# EAGLE design MM-Schematic (EAGLE 8.2.2)
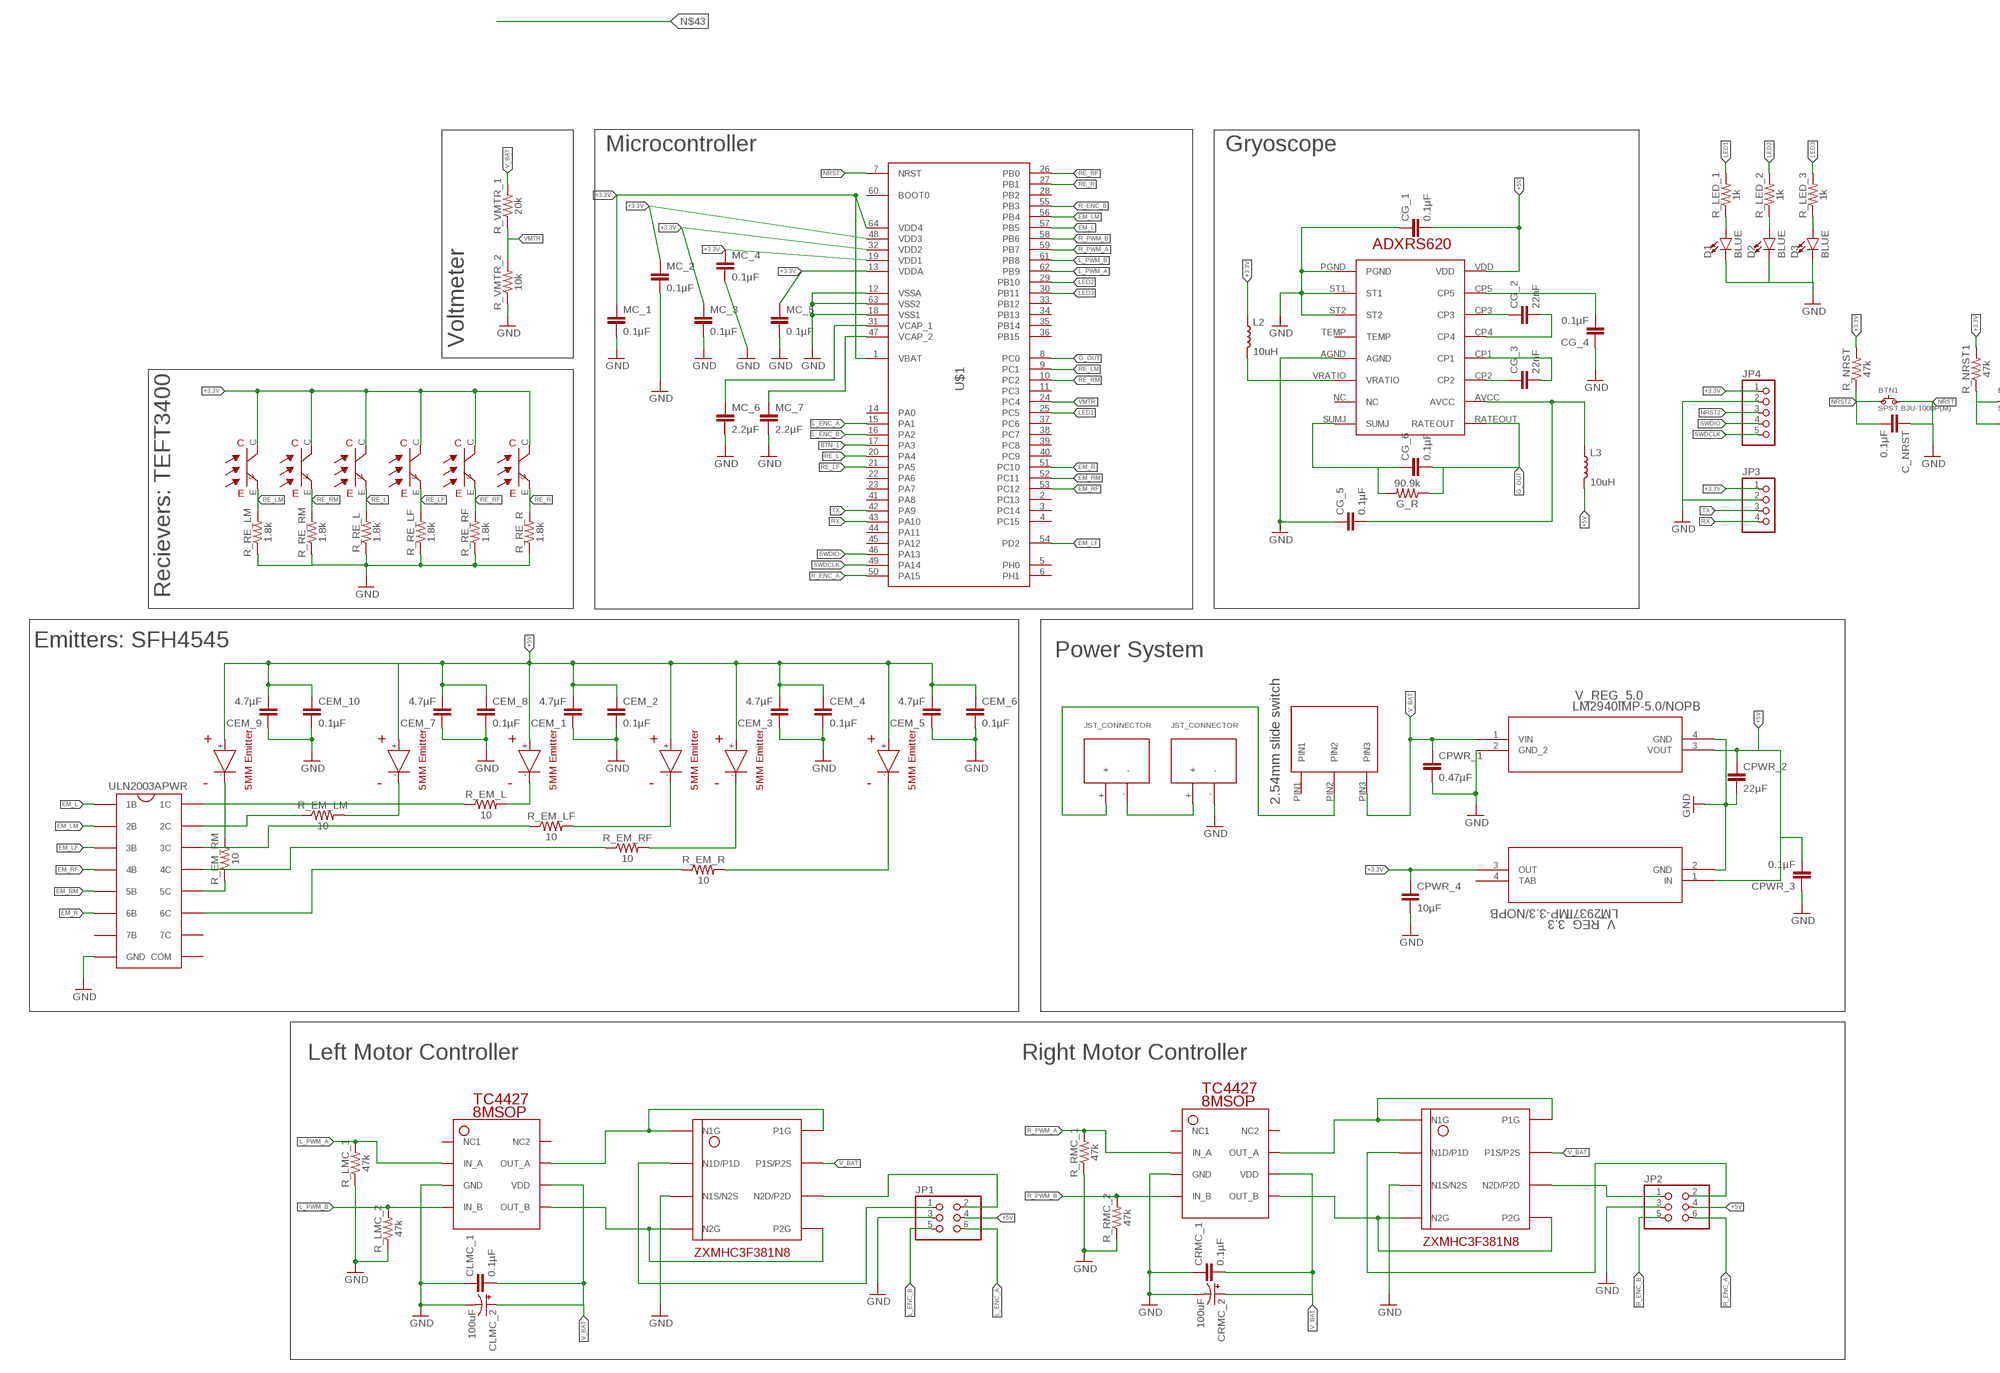
[diagram p0: schematic, sheet 1, part 1 of 2]
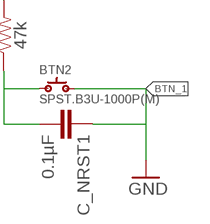
[diagram p1: schematic, sheet 1, part 2 of 2]

## Parts
BTN1  SPST.B3U-1000P(M)  [B3U-1000P(M)]
BTN2  SPST.B3U-1000P(M)  [B3U-1000P(M)]
C_NRST  0.1µF  0.33UF/330NF-0805-50V-10%  [0805]
C_NRST1  0.1µF  0.33UF/330NF-0805-50V-10%  [0805]
CEM_1  4.7µF  0.33UF/330NF-0805-50V-10%  [0805]
CEM_2  0.1µF  0.33UF/330NF-0805-50V-10%  [0805]
CEM_3  4.7µF  0.33UF/330NF-0805-50V-10%  [0805]
CEM_4  0.1µF  0.33UF/330NF-0805-50V-10%  [0805]
CEM_5  4.7µF  0.33UF/330NF-0805-50V-10%  [0805]
CEM_6  0.1µF  0.33UF/330NF-0805-50V-10%  [0805]
CEM_7  4.7µF  0.33UF/330NF-0805-50V-10%  [0805]
CEM_8  0.1µF  0.33UF/330NF-0805-50V-10%  [0805]
CEM_9  4.7µF  0.33UF/330NF-0805-50V-10%  [0805]
CEM_10  0.1µF  0.33UF/330NF-0805-50V-10%  [0805]
CG_1  0.1µF  0.33UF/330NF-0805-50V-10%  [0805]
CG_2  22nF  0.33UF/330NF-0805-50V-10%  [0805]
CG_3  22nF  0.33UF/330NF-0805-50V-10%  [0805]
CG_4  0.1µF  0.33UF/330NF-0805-50V-10%  [0805]
CG_5  0.1µF  0.33UF/330NF-0805-50V-10%  [0805]
CG_6  0.1µF  0.33UF/330NF-0805-50V-10%  [0805]
CLMC_1  0.1µF  0.33UF/330NF-0805-50V-10%  [0805]
CLMC_2  100uF  100UF-POLAR-EIA7343-10V-10%(TANT)  [EIA7343]
CPWR_1  0.47µF  0.33UF/330NF-0805-50V-10%  [0805]
CPWR_2  22µF  0.33UF/330NF-0805-50V-10%  [0805]
CPWR_3  0.1µF  0.33UF/330NF-0805-50V-10%  [0805]
CPWR_4  10µF  0.33UF/330NF-0805-50V-10%  [0805]
CRMC_1  0.1µF  0.33UF/330NF-0805-50V-10%  [0805]
CRMC_2  100uF  100UF-POLAR-EIA7343-10V-10%(TANT)  [EIA7343]
D1  BLUE  LED-BLUE0603  [LED-0603]
D2  BLUE  LED-BLUE0603  [LED-0603]
D3  BLUE  LED-BLUE0603  [LED-0603]
G_R  90.9k  0.75OHM-0805-1/4W-1%  [0805]
JP1  PINHD-2X3  [2X03]
JP2  PINHD-2X3  [2X03]
JP3  PINHD-1X4  [1X04]
JP4  PINHD-1X55X2MM  [1_05X2MM]
L2  10uH  INDUCTOR-0805-3.3UH  [0805]
L3  10uH  INDUCTOR-0805-3.3UH  [0805]
MC_1  0.1µF  0.33UF/330NF-0805-50V-10%  [0805]
MC_2  0.1µF  0.33UF/330NF-0805-50V-10%  [0805]
MC_3  0.1µF  0.33UF/330NF-0805-50V-10%  [0805]
MC_4  0.1µF  0.33UF/330NF-0805-50V-10%  [0805]
MC_5  0.1µF  0.33UF/330NF-0805-50V-10%  [0805]
MC_6  2.2µF  0.33UF/330NF-0805-50V-10%  [0805]
MC_7  2.2µF  0.33UF/330NF-0805-50V-10%  [0805]
R_EM_L  10  0.75OHM-0805-1/4W-1%  [0805]
R_EM_LF  10  0.75OHM-0805-1/4W-1%  [0805]
R_EM_LM  10  0.75OHM-0805-1/4W-1%  [0805]
R_EM_R  10  0.75OHM-0805-1/4W-1%  [0805]
R_EM_RF  10  0.75OHM-0805-1/4W-1%  [0805]
R_EM_RM  10  0.75OHM-0805-1/4W-1%  [0805]
R_LED_1  1k  0.75OHM-0805-1/4W-1%  [0805]
R_LED_2  1k  0.75OHM-0805-1/4W-1%  [0805]
R_LED_3  1k  0.75OHM-0805-1/4W-1%  [0805]
R_LMC_1  47k  0.75OHM-0805-1/4W-1%  [0805]
R_LMC_2  47k  0.75OHM-0805-1/4W-1%  [0805]
R_NRST  47k  0.75OHM-0805-1/4W-1%  [0805]
R_NRST1  47k  0.75OHM-0805-1/4W-1%  [0805]
R_RE_L  1.8k  0.75OHM-0805-1/4W-1%  [0805]
R_RE_LF  1.8k  0.75OHM-0805-1/4W-1%  [0805]
R_RE_LM  1.8k  0.75OHM-0805-1/4W-1%  [0805]
R_RE_R  1.8k  0.75OHM-0805-1/4W-1%  [0805]
R_RE_RF  1.8k  0.75OHM-0805-1/4W-1%  [0805]
R_RE_RM  1.8k  0.75OHM-0805-1/4W-1%  [0805]
R_RMC_1  47k  0.75OHM-0805-1/4W-1%  [0805]
R_RMC_2  47k  0.75OHM-0805-1/4W-1%  [0805]
R_VMTR_1  20k  0.75OHM-0805-1/4W-1%  [0805]
R_VMTR_2  10k  0.75OHM-0805-1/4W-1%  [0805]
U$1  STM32F405XXSTM32F405XX  [LQFP64]
U$2  RECEIVER  [RECEIVER]
U$3  RECEIVER  [RECEIVER]
U$4  RECEIVER  [RECEIVER]
U$5  RECEIVER  [RECEIVER]
U$6  ADXRS620  [ADXRS620]
U$7  EMITTER  [EMITTER]
U$8  EMITTER  [EMITTER]
U$9  EMITTER  [EMITTER]
U$10  EMITTER  [EMITTER]
U$11  ULN2003APWR  [ULN2003APWR]
U$12  JST_CONNECTOR_FEMALE  [JST_CONNECTOR_FEMALE]
U$13  JST_CONNECTOR_FEMALE  [JST_CONNECTOR_FEMALE]
U$14  TS02_SWITCH  [TS02_SWITCH]
U$15  TC4427(8MSOP)  [TC4427(8MSOP)]
U$16  ZXMHC3F381N8  [ZXMHC3F381N8]
U$17  TC4427(8MSOP)  [TC4427(8MSOP)]
U$18  ZXMHC3F381N8  [ZXMHC3F381N8]
U$20  EMITTER  [EMITTER]
U$21  EMITTER  [EMITTER]
U$22  RECEIVER  [RECEIVER]
U$23  RECEIVER  [RECEIVER]
V_REG_3.3  LM2937IMP-3.3/NOPB  [MP04A]
V_REG_5.0  LM2940IMP-5.0/NOPB  [MP04A]

## Nets
+3.3V: CPWR_4.1 JP3.1 JP4.1 L2.1 MC_1.1 MC_2.1 MC_3.1 MC_4.1 MC_5.1 R_NRST1.2 R_NRST.2 U$1.1(VBAT) U$1.13(VDDA) U$1.19(VDD1) U$1.32(VDD2) U$1.48(VDD3) U$1.64(VDD4) U$2.C U$3.C U$4.C U$5.C U$22.C U$23.C V_REG_3.3.3(OUT)
+5V: CEM_1.2 CEM_2.1 CEM_3.2 CEM_4.1 CEM_5.2 CEM_6.1 CEM_7.2 CEM_8.1 CEM_9.2 CEM_10.1 CG_1.2 CPWR_2.1 CPWR_3.2 JP1.4 JP2.4 L3.2 U$6.VDD U$7.+ U$8.+ U$9.+ U$10.+ U$20.+ U$21.+ V_REG_3.3.1(IN) V_REG_5.0.3(VOUT)
BTN_1: BTN2.2 C_NRST1.1 U$1.17(PA3) ; supply symbol labelled GND
EM_L: U$1.57(PB5) U$11.1B
EM_LF: U$1.54(PD2) U$11.3B
EM_LM: U$1.56(PB4) U$11.2B
EM_R: U$1.51(PC10) U$11.6B
EM_RF: U$1.53(PC12) U$11.4B
EM_RM: U$1.52(PC11) U$11.5B
G_OUT: CG_6.2 G_R.1 U$1.8(PC0) U$6.RATEOUT
GND: CEM_1.1 CEM_2.2 CEM_3.1 CEM_4.2 CEM_5.1 CEM_6.2 CEM_7.1 CEM_8.2 CEM_9.1 CEM_10.2 CG_4.1 CG_5.1 CLMC_1.1 CLMC_2.C(-) CPWR_1.2 CPWR_2.2 CPWR_3.1 CPWR_4.2 CRMC_1.1 CRMC_2.C(-) D1.C D2.C D3.C JP1.3 JP2.3 JP3.2 JP4.2 MC_1.2 MC_2.2 MC_3.2 MC_4.2 MC_5.2 MC_6.2 MC_7.2 R_LMC_1.1 R_LMC_2.1 R_RE_L.1 R_RE_LF.1 R_RE_LM.1 R_RE_R.1 R_RE_RF.1 R_RE_RM.1 R_RMC_1.1 R_RMC_2.1 R_VMTR_2.1 U$1.12(VSSA) U$1.18(VSS1) U$1.63(VSS2) U$6.AGND U$11.GND U$13.- U$15.GND U$16.N1S/N2S U$17.GND U$18.N1S/N2S V_REG_3.3.2(GND) V_REG_5.0.2(GND_2) V_REG_5.0.4(GND)
L_ENC_A: JP1.6 U$1.15(PA1)
L_ENC_B: JP1.5 U$1.16(PA2)
L_PWM_A: R_LMC_1.2 U$1.62(PB9) U$15.IN_A
L_PWM_B: R_LMC_2.2 U$1.61(PB8) U$15.IN_B
LED1: R_LED_1.2 U$1.25(PC5)
LED2: R_LED_2.2 U$1.29(PB10)
LED3: R_LED_3.2 U$1.30(PB11)
N$1: CG_5.2 L3.1 U$6.AVCC
N$2: D2.A R_LED_2.1
N$3: CG_1.1 U$6.PGND U$6.ST1 U$6.ST2 ; supply symbol labelled GND
N$4: CG_4.2 U$6.CP5
N$5: CG_2.2 U$6.CP4
N$6: MC_6.1 U$1.31(VCAP_1)
N$7: MC_7.1 U$1.47(VCAP_2)
N$8: CG_2.1 U$6.CP3
N$9: CG_3.1 U$6.CP2
N$10: CG_3.2 U$6.CP1
N$11: L2.2 U$6.VRATIO
N$12: CG_6.1 G_R.2 U$6.SUMJ
N$13: U$12.- U$13.+
N$14: U$12.+ U$14.PIN2
N$15: R_EM_L.2 U$7.-
N$16: R_EM_L.1 U$11.1C
N$17: R_EM_LF.1 U$11.3C
N$18: D1.A R_LED_1.1
N$19: R_EM_RF.1 U$11.4C
N$20: R_EM_RF.2 U$9.-
N$21: R_EM_R.1 U$11.6C
N$22: R_EM_R.2 U$10.-
N$25: U$15.OUT_B U$16.N2G U$16.P2G
N$26: U$15.OUT_A U$16.N1G U$16.P1G
N$27: JP1.1 U$16.N1D/P1D
N$28: JP1.2 U$16.N2D/P2D
N$33: U$17.OUT_B U$18.N2G U$18.P2G
N$34: U$17.OUT_A U$18.N1G U$18.P1G
N$35: JP2.2 U$18.N1D/P1D
N$36: JP2.1 U$18.N2D/P2D
N$40: D3.A R_LED_3.1
N$41: BTN2.1 C_NRST1.2 R_NRST1.1
N$42: R_EM_LM.1 U$11.2C
N$46: R_EM_LM.2 U$20.-
N$47: R_EM_RM.2 U$21.-
N$48: R_EM_RM.1 U$11.5C
NRST: BTN1.2 C_NRST.1 U$1.7(NRST) ; supply symbol labelled GND
NRST2: BTN1.1 C_NRST.2 JP4.3 R_NRST.1
R_EM_RF: R_EM_LF.2 U$8.-
R_ENC_A: JP2.6 U$1.50(PA15)
R_ENC_B: JP2.5 U$1.55(PB3)
R_PWM_A: R_RMC_1.2 U$1.59(PB7) U$17.IN_A
R_PWM_B: R_RMC_2.2 U$1.58(PB6) U$17.IN_B
RE_L: R_RE_L.2 U$1.20(PA4) U$2.E
RE_LF: R_RE_LF.2 U$1.21(PA5) U$3.E
RE_LM: R_RE_LM.2 U$1.9(PC1) U$23.E
RE_R: R_RE_R.2 U$1.27(PB1) U$5.E
RE_RF: R_RE_RF.2 U$1.26(PB0) U$4.E
RE_RM: R_RE_RM.2 U$1.10(PC2) U$22.E
RX: JP3.4 U$1.43(PA10)
SWDCLK: JP4.5 U$1.49(PA14)
SWDIO: JP4.4 U$1.46(PA13)
TX: JP3.3 U$1.42(PA9)
V_BAT: CLMC_1.2 CLMC_2.A(+) CPWR_1.1 CRMC_1.2 CRMC_2.A(+) R_VMTR_1.2 U$14.PIN3 U$15.VDD U$16.P1S/P2S U$17.VDD U$18.P1S/P2S V_REG_5.0.1(VIN)
VMTR: R_VMTR_1.1 R_VMTR_2.2 U$1.24(PC4)
Unconnected: U$1.2(PC13) U$1.3(PC14) U$1.4(PC15) U$1.5(PH0) U$1.6(PH1) U$1.11(PC3) U$1.14(PA0) U$1.22(PA6) U$1.23(PA7) U$1.28(PB2) U$1.33(PB12) U$1.34(PB13) U$1.35(PB14) U$1.36(PB15) U$1.37(PC6) U$1.38(PC7) U$1.39(PC8) U$1.40(PC9) U$1.41(PA8) U$1.44(PA11) U$1.45(PA12) U$1.60(BOOT0) U$6.NC U$6.TEMP U$11.7B U$11.7C U$11.COM U$14.PIN1 U$15.NC1 U$15.NC2 U$17.NC1 U$17.NC2

## Notes on the sheet
- Microcontroller | Gryoscope
- Voltmeter
- Recievers: TEFT3400
- Emitters: SFH4545
- Power System
- Left Motor Controller | Right Motor Controller

## Power pins joined to a net without a drawn wire
TAB: V_REG_3.3.4(TAB)

## Library data of the parts
BTN1 BTN2 = omron:SPST
C_NRST C_NRST1 CEM_1-CEM_10 CG_1-CG_6 CLMC_1 CPWR_1-CPWR_4 CRMC_1 MC_1-MC_7 = SparkFun-Capacitors:0.33UF/330NF: 0.33µF/330nF ceramic capacitors A capacitor is a passive two-terminal electrical component used to store electrical energy temporarily in an electric field.; PROD_ID: CAP-08469; VALUE: 0.33µF
CLMC_2 CRMC_2 = SparkFun-Capacitors:100UF-POLAR: 100µF polarized capacitors A capacitor is a passive two-terminal electrical component used to store electrical energy temporarily in an electric field.; PROD_ID: CAP-07890
D1-D3 = SparkFun-LED:LED-BLUE: Blue SMD LED Used in manufacturing of various products at SparkFun Packages: 0603 - SMD 0603 package [Product Link] <http://www.digikey.com/product-detail/en/SMLE12BC7TT86/511-1589-2-ND/1641808> 1206 - SMD1206 package [Product Link] <http://www.digikey.com/product-detail/en/lite-on-inc/LTST-C150TBKT/160-1643-1-ND/573584> SparkFun Products: ESP8266 Thing-Dev Board <https://www.sparkfun.com/products/13711> RedBoard <https://www.sparkfun.com/products/12757>; PROD_ID: DIO-08575
G_R R_EM_L R_EM_LF R_EM_LM R_EM_R R_EM_RF R_EM_RM R_LED_1-R_LED_3 R_LMC_1 R_LMC_2 R_NRST R_NRST1 R_RE_L R_RE_LF R_RE_LM R_RE_R R_RE_RF R_RE_RM R_RMC_1 R_RMC_2 R_VMTR_1 R_VMTR_2 = SparkFun-Resistors:0.75OHM: 0.75Ω resistor A resistor is a passive two-terminal electrical component that implements electrical resistance as a circuit element. Resistors act to reduce current flow, and, at the same time, act to lower voltage levels within circuits. - Wikipedia; PROD_ID: RES-08474; VALUE: 0.75
JP1 JP2 = pinhead:PINHD-2X3: PIN HEADER
JP3 = pinhead:PINHD-1X4: PIN HEADER
JP4 = pinhead:PINHD-1X5: PIN HEADER
L2 L3 = SparkFun-Coils:INDUCTOR: Inductors Resist changes in electrical current. Basically a coil of wire. SparkFun Products: SparkFun Load Cell Amplifier - HX711 <https://www.sparkfun.com/products/13879> IOIO-OTG - V2.2 <https://www.sparkfun.com/products/13613>; PROD_ID: NDUC-13076; VALUE: 3.3µH/±20%/450mA
U$1 = stm32f:STM32F405XX: Features • Core: ARM 32-bit Cortex™-M4 CPU with FPU, Adaptive real-time accelerator (ART Accelerator™) allowing 0-wait state execution from Flash memory, frequency up to 168 MHz, memory protection unit, 210 DMIPS/ 1.25 DMIPS/MHz (Dhrystone 2.1), and DSP instructions • Memories – Up to 1 Mbyte of Flash memory – Up to 192+4 Kbytes of SRAM including 64- Kbyte of CCM (core coupled memory) data RAM – Flexible static memory controller supporting Compact Flash, SRAM, PSRAM, NOR and NAND memories • LCD parallel interface, 8080/6800 modes • Clock, reset and supply management – 1.8 V to 3.6 V application supply and I/Os – POR, PDR, PVD and BOR – 4-to-26 MHz crystal oscillator – Internal 16 MHz factory-trimmed RC (1% accuracy) – 32 kHz oscillator for RTC with calibration – Internal 32 kHz RC with calibration • Low power – Sleep, Stop and Standby modes – VBAT supply for RTC, 20×32 bit backup registers + optional 4 KB backup SRAM • 3×12-bit, 2.4 MSPS A/D converters: up to 24 channels and 7.2 MSPS in triple interleaved mode • 2×12-bit D/A converters • General-purpose DMA: 16-stream DMA controller with FIFOs and burst support • Up to 17 timers: up to twelve 16-bit and two 32- bit timers up to 168 MHz, each with up to 4 IC/OC/PWM or pulse counter and quadrature (incremental) encoder input • Debug mode – Serial wire debug (SWD) & JTAG interfaces – Cortex-M4 Embedded Trace Macrocell™ • Up to 140 I/O ports with interrupt capability – Up to 136 fast I/Os up to 84 MHz – Up to 138 5 V-tolerant I/Os • Up to 15 communication interfaces – Up to 3 × I2C interfaces (SMBus/PMBus) – Up to 4 USARTs/2 UARTs (10.5 Mbit/s, ISO 7816 interface, LIN, IrDA, modem control) – Up to 3 SPIs (42 Mbits/s), 2 with muxed full-duplex I2S to achieve audio class accuracy via internal audio PLL or external clock – 2 × CAN interfaces (2.0B Active) – SDIO interface • Advanced connectivity – USB 2.0 full-speed device/host/OTG controller with on-chip PHY – USB 2.0 high-speed/full-speed device/host/OTG controller with dedicated DMA, on-chip full-speed PHY and ULPI – 10/100 Ethernet MAC with dedicated DMA: supports IEEE 1588v2 hardware, MII/RMII • 8- to 14-bit parallel camera interface up to 54 Mbytes/s • True random number generator • CRC calculation unit • 96-bit unique ID • RTC: subsecond accuracy, hardware calendar
U$2-U$5 U$22 U$23 = sfh4550 & teft4300:RECEIVER
U$6 = ADXRS620:ADXRS620
U$7-U$10 U$20 U$21 = sfh4550 & teft4300:EMITTER
U$11 = ULN2003APWR:ULN2003APWR
U$12 U$13 = JST_CONNECTOR_FEMALE. through hole:JST_CONNECTOR_FEMALE
U$14 = 2.54mm slide switch:TS02_SWITCH
U$15 U$17 = TC4427(8MSOP):TC4427(8MSOP)
U$16 U$18 = ZXMHC3F381N8:ZXMHC3F381N8
V_REG_3.3 = LM2937IMP-3.3:LM2937IMP-3.3/NOPB; COPYRIGHT: Copyright C 2015 Accelerated Designs. All rights reserved; MANUFACTURER_PART_NUMBER: lm2937imp3_3nopb; VENDOR: National Semiconductor
V_REG_5.0 = LM2940IMP-5.0:LM2940IMP-5.0/NOPB; 3D_LIBRARY_NAME: National_LDO; BASE_PN: LM2940; COMP: TypeLDO; COPYRIGHT: Copyright C 2015 Accelerated Designs. All rights reserved; LIBRARY: ReferenceLM2940IMP; MANUFACTURER_PART_NUMBER: LM2940IMP5.0NOPB; PIN: Count4; SYMBOL: NameLM2940IMP50; TYPE: LM2940IMP5.0; VENDOR: National Semiconductor; VERSION: 1

## Board
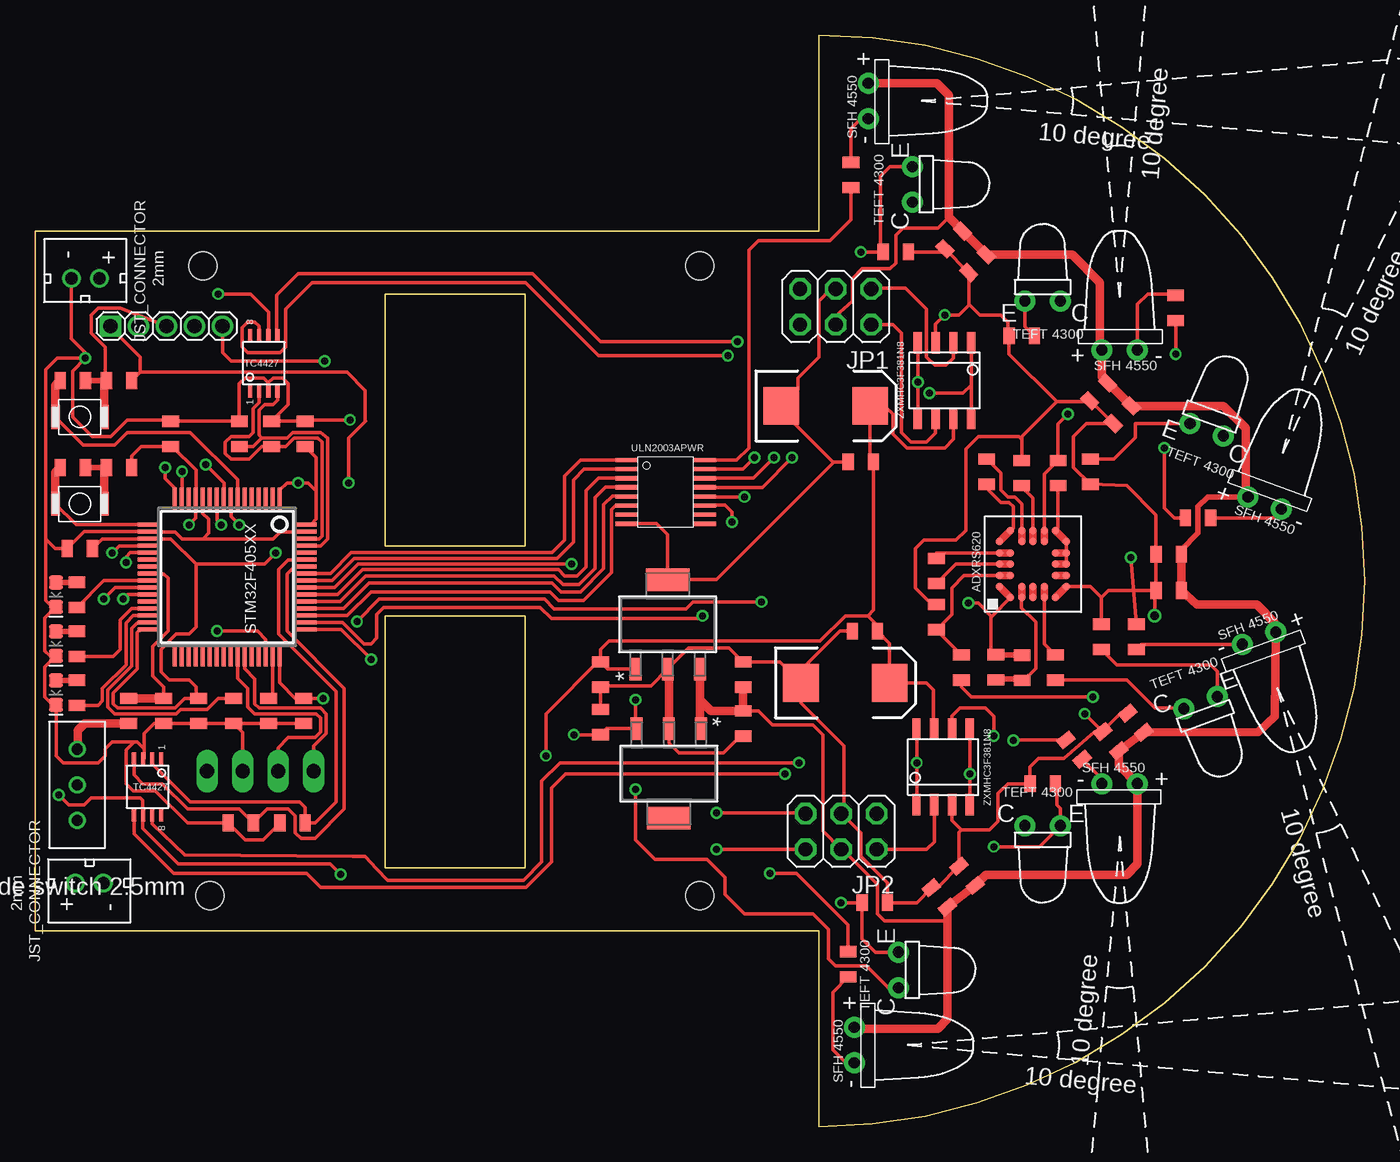
[diagram p2: board, top side]
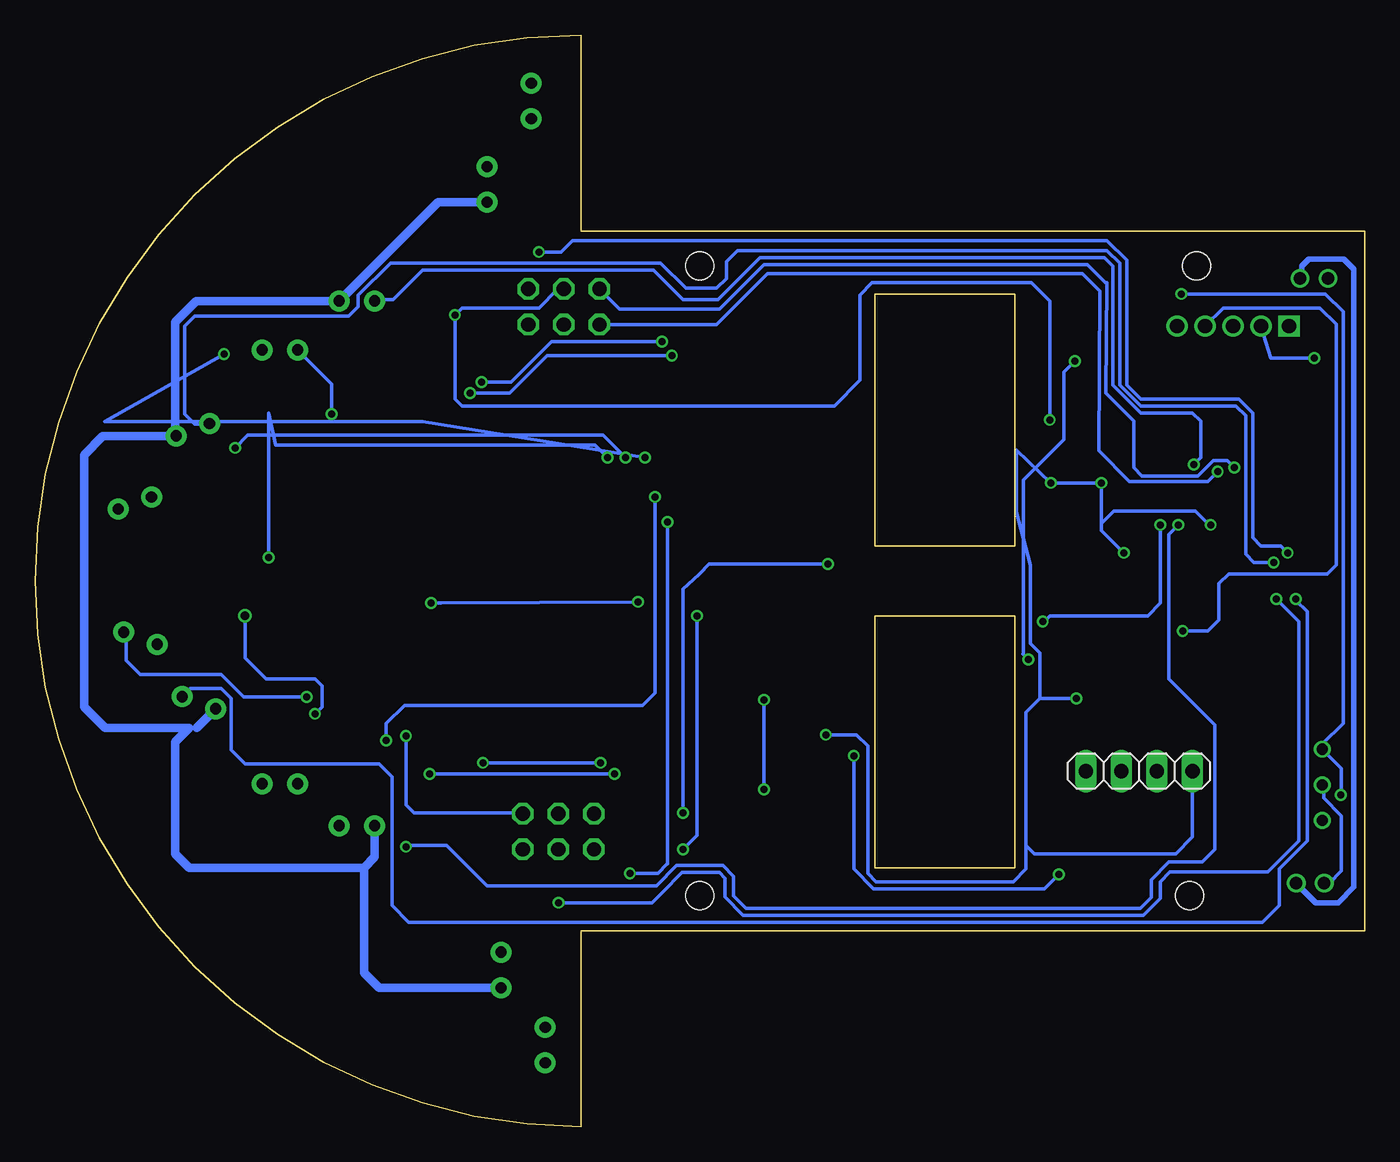
[diagram p3: board, bottom side, seen from below]

Size 95 x 78 mm. Coordinates in mm from the lower left corner, seen from the top.
Copper layers (1*16): Top 0.0356mm / dielectric 1.5011mm / Bottom 0.0356mm
Design rules "oshpark-2layer": minimum track width 6mil, minimum drill 13mil, track to track 6mil, track to pad 6mil, pad to pad 6mil, via to via 6mil, smd to smd 6mil, copper to edge 15mil, drill to drill 6mil, minimum pad ring 7mil, minimum via ring 7mil, stop-mask expansion 2.5mil, vias tented up to drill 0mil, thermal gap 10mil

### Footprints (pad centres in the part's own frame; a part is rotated, then mirrored left to right if it is on the bottom)
B3U-1000P(M) = smd 0.6 x 1.7: 1 -1.75,0; 2 1.75,0
0805 = smd 0.8 x 1.2: 1 -0.9,0; 2 0.9,0
EIA7343 = smd 2.55 x 2.7: A 3.17,0; C -3.17,0
LED-0603 = smd 1 x 1: A -0.877,0; C 0.877,0
2X03 = drill 1.016 octagon: 1 -2.54,-1.27; 2 -2.54,1.27; 3 0,-1.27; 4 0,1.27; 5 2.54,-1.27; 6 2.54,1.27
1X04 = drill 1.016 long: 1 -3.81,0; 2 -1.27,0; 3 1.27,0; 4 3.81,0
1_05X2MM = drill 1.016 pad 1.3 square: 1 -4,0 | drill 1.016 pad 1.3: 2 -2,0; 3 0,0; 4 2,0; 5 4,0
LQFP64 = smd 1.6 x 0.3: 1 -5.6,3.75; 2 -5.6,3.25; 3 -5.6,2.75; 4 -5.6,2.25; 5 -5.6,1.75; 6 -5.6,1.25; 7 -5.6,0.75; 8 -5.6,0.25; 9 -5.6,-0.25; 10 -5.6,-0.75; 11 -5.6,-1.25; 12 -5.6,-1.75; 13 -5.6,-2.25; 14 -5.6,-2.75; 15 -5.6,-3.25; 16 -5.6,-3.75; 33 5.6,-3.75; 34 5.6,-3.25; 35 5.6,-2.75; 36 5.6,-2.25; 37 5.6,-1.75; 38 5.6,-1.25; 39 5.6,-0.75; 40 5.6,-0.25; 41 5.6,0.25; 42 5.6,0.75; 43 5.6,1.25; 44 5.6,1.75; 45 5.6,2.25; 46 5.6,2.75; 47 5.6,3.25; 48 5.6,3.75 | smd 0.3 x 1.6: 17 -3.75,-5.6; 18 -3.25,-5.6; 19 -2.75,-5.6; 20 -2.25,-5.6; 21 -1.75,-5.6; 22 -1.25,-5.6; 23 -0.75,-5.6; 24 -0.25,-5.6; 25 0.25,-5.6; 26 0.75,-5.6; 27 1.25,-5.6; 28 1.75,-5.6; 29 2.25,-5.6; 30 2.75,-5.6; 31 3.25,-5.6; 32 3.75,-5.6; 49 3.75,5.6; 50 3.25,5.6; 51 2.75,5.6; 52 2.25,5.6; 53 1.75,5.6; 54 1.25,5.6; 55 0.75,5.6; 56 0.25,5.6; 57 -0.25,5.6; 58 -0.75,5.6; 59 -1.25,5.6; 60 -1.75,5.6; 61 -2.25,5.6; 62 -2.75,5.6; 63 -3.25,5.6; 64 -3.75,5.6
RECEIVER = drill 0.8 pad 1.5: C 1.27,-0.5; E -1.27,-0.5
ADXRS620 = smd 0.55 x 0.55: AGND -1.6,-2.4; AVCC -0.8,2.4; CP1 0.8,2.4; CP2 0,2.4; CP3 2.4,0.8; CP4 1.6,2.4; CP5 2.4,0; NC -2.4,0; P$1 -1.6,0; P$3 -1.6,0.8; P$5 -2.4,1.6; P$6 -1.6,-0.8; P$8 -2.4,-1.6; P$9 -0.8,-1.6; P$10 0,-1.6; P$11 0.8,-1.6; P$16 1.6,-2.4; P$17 1.6,-0.8; P$21 1.6,0; P$22 1.6,0.8; P$24 2.4,1.6; P$25 0.8,1.6; P$26 0,1.6; P$27 -0.8,1.6; PGND 2.4,-1.6; RATEOUT -1.6,2.4; ST1 0.8,-2.4; ST2 0,-2.4; SUMJ -2.4,0.8; TEMP -0.8,-2.4; VDD 2.4,-0.8; VRATIO -2.4,-0.8
EMITTER = drill 0.8 pad 1.5: + -1.27,-0.5; - 1.27,-0.5
ULN2003APWR = smd 1.55 x 0.3: 1B -2.8,2.275; 1C 2.8,2.275; 2B -2.8,1.625; 2C 2.8,1.625; 3B -2.8,0.975; 3C 2.8,0.975; 4B -2.8,0.325; 4C 2.8,0.325; 5B -2.8,-0.325; 5C 2.8,-0.325; 6B -2.8,-0.975; 6C 2.8,-0.975; 7B -2.8,-1.625; 7C 2.8,-1.625; COM 2.8,-2.275; GND -2.8,-2.275
JST_CONNECTOR_FEMALE = drill 0.889: + 0,1; - 0,-1
TS02_SWITCH = drill 0.8: PIN1 0,2.54; PIN2 0,0; PIN3 0,-2.54
TC4427(8MSOP) = smd 0.95 x 0.3: GND -1.975,-0.325; IN_A -1.975,0.325; IN_B -1.975,-0.975; NC1 -1.975,0.975; NC2 1.975,0.975; OUT_A 1.975,0.325; OUT_B 1.975,-0.975; VDD 1.975,-0.325
ZXMHC3F381N8 = smd 0.6 x 1.55: N1D/P1D -0.635,-2.7; N1G -1.905,-2.7; N1S/N2S 0.635,-2.7; N2D/P2D 0.635,2.7; N2G 1.905,-2.7; P1G -1.905,2.7; P1S/P2S -0.635,2.7; P2G 1.905,2.7
MOUSE10 = hole 2: -22.5,17.5; -22.5,-18; 22.5,-17.5; 22.5,17.5
MP04A = smd 1.6 x 0.838: 1 -3.2,2.3; 2 -3.2,0; 3 -3.2,-2.3 | smd 1.6 x 3.099: 4 3.2,0

### Placement (x,y rotation side)
BTN1  3.2,50.7 180 top
BTN2  3.2,44.5 180 top
C_NRST  2.7,53.3 0 top
C_NRST1  2.7,47.1 0 top
CEM_1  65.65,63.35 45 top
CEM_2  67.35,61.65 225 top
CEM_3  81,40.9 0 top
CEM_4  81,38.3 180 top
CEM_5  66.6,17.92 310 top
CEM_6  64.62,16.37 130 top
CEM_7  78.65,28.86 310 top
CEM_8  76.86,27.54 130 top
CEM_9  76,52.5 45 top
CEM_10  77.7,50.86 225 top
CG_1  73.1,46.7 90 top
CG_2  68,46.8 270 top
CG_3  64.4,39.7 90 top
CG_4  70.5,46.7 270 top
CG_5  64.4,36.4 270 top
CG_6  68.66,32.81 90 top
CLMC_1  59,47.5 0 top
CLMC_2  57.9,31.7 0 top
CPWR_1  40.4,32.3 270 top
CPWR_2  50.6,28.8 270 top
CPWR_3  50.6,32.3 270 top
CPWR_4  40.4,28.9 90 top
CRMC_1  59.3,35.4 0 top
CRMC_2  56.5,51.5 0 top
D1  1.5,38 270 top
D2  1.5,34.5 270 top
D3  1.5,31 270 top
G_R  70.53,32.78 270 top
JP1  57.21,58.58 180 top
JP2  57.6,21.08 180 top
JP3  16.1,25.4 180 bottom
JP4  9.4,57.2 0 top
L2  72.9,32.8 90 top
L3  66.2,32.8 270 top
MC_1  19.3,49.5 90 top
MC_2  19.2,29.7 270 top
MC_3  11.7,29.7 270 top
MC_4  3.2,41.3 180 top
MC_5  9.7,49.5 90 top
MC_6  14.2,29.7 270 top
MC_7  16.7,29.7 270 top
R_EM_L  58.3,68 90 top
R_EM_LF  83.1,43.5 0 top
R_EM_LM  81.5,58.5 90 top
R_EM_R  58.1,11.6 270 top
R_EM_RF  78.7,35 270 top
R_EM_RM  74.24,26.93 310 top
R_LED_1  3,38 270 top
R_LED_2  3,34.5 270 top
R_LED_3  3,31 270 top
R_LMC_1  16.9,49.5 270 top
R_LMC_2  14.6,49.5 270 top
R_NRST  6,53.3 0 top
R_NRST1  6,47.1 0 top
R_RE_L  61.5,62.5 180 top
R_RE_LF  75.4,46.8 90 top
R_RE_LM  70.5,56.5 0 top
R_RE_R  60,16 180 top
R_RE_RF  76.2,35 270 top
R_RE_RM  72,24.5 0 top
R_RMC_1  18.4,21.7 0 top
R_RMC_2  14.7,21.7 0 top
R_VMTR_1  6.7,29.7 270 top
R_VMTR_2  9.2,29.7 90 top
U$1  13.73,39.27 270 top
U$2  63.19,67.33 270 top
U$3  83.89,50.26 340 top
U$4  83.46,29.82 200 top
U$5  62.19,11.19 270 top
U$6  71.31,40.19 90 top
U$7  60.04,73.29 270 top
U$8  88.04,45.03 340 top
U$9  87.64,34.42 200 top
U$10  59.04,5.83 270 top
U$11  45.07,45.35 0 top
U$12  3.88,17.39 90 top
U$13  3.6,60.6 270 top
U$14  3.01,24.42 180 top
U$15  16.35,54.55 90 top
U$16  64.99,53.31 180 top
U$17  8.05,24.27 270 top
U$18  64.89,25.69 0 top
U$19  [MOUSE10]  30,39 270 top
U$20  77.5,56 0 top
U$21  77.5,24 180 top
U$22  72,21 180 top
U$23  72,59.5 0 top
V_REG_3.3  45.29,25.23 270 top
V_REG_5.0  45.21,35.88 90 top

### Tracks (layer width: path | path; a pad name or v marks a point on that pad's centre or on a via)
+3.3V  (via drill 0.5)
  Top 0.254: U$1.64 19.72,43.02 20.1,43.4 20.1,45.4 | 20.1,45.4 20.1,47.8 MC_1.1 | U$1.48 17.48,31.72 18.6,30.6 MC_2.1 v20.6,30.6 | U$1.32 8.11,35.5 7.5,35.5 7.3,35.3 7.3,32.7 5.6,31 5.6,30.2 5.9,29.9 10,29.9 10.7,30.6 MC_3.1 11.5,30.8 11.5,31.4 11,31.9 9.6,31.9 9,32.5 9,34.1 10.1,35.2 11,35.2 11.5,35.7 11.5,40.2 | 8.15,42 9.7,42 11.5,40.2 | 8.15,42 U$1.19 | v38.5,28 CPWR_4.1 40.83,28.43 V_REG_3.3.3 42.9,28.52 v42.9,30.5 | 11.5,44.85 U$1.13 | U$5.C 60.98,9.92 59.4,11.5 57.2,11.5 56.7,12 56.7,14.1 55.6,15.2 50.7,15.2 49.3,16.6 49.3,17.8 48,19.1 44.3,19.1 42.9,20.5 v42.9,24.1 | L2.1 78,31.9 80,29.9 82.05,29.9 U$4.C | U$1.1 17.48,45.48 18,46 v18.8,46 19.5,46 20.1,45.4 | 8.15,42 4.8,42 MC_4.1 | 6.9,53.4 R_NRST.2 7.5,53.9 | U$1.13 11.5,44.89 11.5,46.9 9.8,48.6 MC_5.1 7.6,48.6 6.9,47.9 R_NRST1.2 | 11.5,40.2 16.4,40.2 v17.2,41 | U$1.13 11.48,43.48 v11,43 | 7.5,53.9 22.3,53.9 23.6,52.6 23.6,50.42 23.62,50.4 22.4,49.18 v22.4,46 | JP4.1 5.4,57.1 7.5,55 7.5,53.9
  Bottom 0.254: 85,49.44 U$3.C | 84,28.5 83.45,28.5 | v38.5,28 36.3,28 35.5,27.2 35.5,18.1 34.9,17.5 25.1,17.5 24.2,18.4 24.2,20.1 | 24.2,20.1 24.2,29.6 23.2,30.6 | 23.2,30.6 v20.6,30.6 | 24.2,20.1 23.6,19.5 13.5,19.5 12.29,20.71 JP3.1 | v42.9,24.1 v42.9,30.5 | v17.2,41 18.8,42.6 18.8,43.1 | 18.8,43.1 v18.8,46 v22.4,46 24.89,48.33 24.89,43.93 23.88,40.12 23.88,34.53 23.2,33.85 23.2,30.6 | v11,43 11.1,43 12.1,44 17.9,44 18.8,43.1
  Bottom 0.61: U$2.C 66.21,66.06 U$23.C 83.5,59 85,57.5 85,49.44 | U$3.C 90.14,49.35 91.5,48 91.5,30 90,28.5 84,28.5 85,27.5 85,19.5 84,18.5 71.5,18.5 | 83.45,28.5 U$4.C | U$22.C 70.73,19.27 71.5,18.5 | U$5.C 70.42,9.92 71.5,11 71.5,18.5
+5V  (via drill 0.5)
  Top 0.254: U$6.VDD 72.11,46.61 CG_1.2 73.1,50.2 v73.8,50.9 | CEM_1.2 | 76.23,53.54 CEM_9.2 76.69,53.14 | 86.5,45.17 U$8.+ 86.67,45 | 58.64,7 U$10.+ | CPWR_2.1 51.7,29.7 52.7,28.7 55.6,28.7 56.3,28 56.3,21.11 JP2.4 57.69,19.81 60.2,17.3 60.2,15.2 60.7,14.7 64.9,14.7 65.2,15 | JP1.4 57.21,57.91 58.4,59 58.4,60.6 59.1,61.3 61.1,61.3 61.5,61.7 61.5,63.7 62,64.2 64.53,64.2 65.3,64.97 | L3.2 66.2,31.4 66.9,30.7 v75.6,30.7 | CEM_3.2 81.9,41.2
  Top 0.406: 81.9,41.2 83.1,42.4 83.1,44.3 83.8,45 86.67,45
  Top 0.61: V_REG_5.0.3 47.51,30.5 | 47.51,30.5 47.51,28.51 V_REG_3.3.1 | CPWR_3.2 CPWR_2.1 48.31,29.7 47.51,30.5 | U$7.+ 64.44,74.56 65.3,73.7 65.3,64.97 CEM_1.2 | CEM_1.2 CEM_2.1 74.11,62.29 76.1,60.3 76.1,55.63 U$20.+ 76.23,53.54 | 76.69,53.14 CEM_10.1 84.91,51.49 86.5,49.9 86.5,45.17 | CEM_3.2 CEM_4.1 83,37.3 87.3,37.3 88.6,36 88.6,35.9 88.66,35.84 U$9.+ 88.6,29.3 87.4,28.2 CEM_7.2 CEM_8.1 77.44,25.83 U$21.+ 78.77,18.77 78,18 67.95,18 CEM_5.2 CEM_6.1 65.2,15 65.2,7.7 64.5,7 58.64,7
  Bottom 0.254: v73.8,50.9 73.8,53.07 U$20.+ | v75.6,30.7 80.1,30.7 81.7,32.3 87.5,32.3 88.5,33.3 88.5,35.16 U$9.+
BTN_1
  Top 0.254: U$1.17 2.93,43.02 BTN2.2
  Top 0.61: BTN2.2 1.45,46.75 C_NRST1.1
EM_L
  Top 0.254: U$1.57 21.12,39.52 22.61,41.01 36.96,41.01 37.85,41.89 37.85,46.47 38.99,47.61 42.25,47.61 U$11.1B
EM_LF
  Top 0.254: U$1.54 21.62,38.02 23.4,39.8 37.4,39.8 37.85,39.35 38.73,39.35 39.37,39.99 39.37,45.45 40.26,46.34 42.26,46.34 U$11.3B
EM_LM
  Top 0.254: U$11.2B 39.24,46.98 38.48,46.21 38.48,41.77 37.31,40.6 22.8,40.6 21.22,39.02 U$1.56
EM_R
  Top 0.254: U$1.51 22.32,36.52 24,38.2 36.8,38.2 37.4,37.6 39.2,37.6 41.2,39.6 41.2,44.1 41.5,44.4 42.24,44.4 U$11.6B
EM_RF
  Top 0.254: U$1.53 21.79,37.52 23.62,39.35 37.08,39.35 37.72,38.72 38.86,38.72 40.01,39.86 40.01,44.94 40.77,45.7 42.24,45.7 U$11.4B
EM_RM
  Top 0.254: U$1.52 22.05,37.02 23.88,38.85 36.96,38.85 37.59,38.21 38.99,38.21 40.64,39.86 40.64,44.43 41.27,45.07 42.23,45.07 U$11.5B
G_OUT  (via drill 0.5)
  Top 0.254: v14.6,43 14,43.6 14,44.85 U$1.8 | v23,36.1 24.6,37.7 36.4,37.7 37.1,37 46.5,37 47,37.5 v51.9,37.5 | v66.7,37.4 67.4,37.4 68.3,36.5 | 68.3,36.5 68.42,36.5 69.71,37.79 | 68.3,36.5 68.3,34.07 CG_6.2
  Top 0.406: G_R.1 68.66,33.69 CG_6.2
  Bottom 0.254: v51.9,37.5 66,37.4 v66.7,37.4 | v14.6,43 14.6,37.4 15.5,36.5 22.5,36.5 22.9,36.1 v23,36.1
GND  (via drill 0.5, 0.61)
  Top 0.254: MC_1.2 R_LMC_1.1 18.1,51.6 18.1,53.1 17.7,53.5 17,53.5 16.68,53.17 | U$15.GND 16.68,53.17 | MC_6.2 MC_3.2 R_VMTR_2.1 8.5,28.8 7.8,28.1 7.8,27 | MC_6.2 MC_7.2 MC_2.2 | 7.8,27 7.8,26.32 U$17.GND | CPWR_4.2 CPWR_1.2 40.5,31.5 44,31.5 45.18,32.68 V_REG_5.0.2 45.21,32.71 46.7,34.2 49.6,34.2 CPWR_3.1 53.23,33.2 CLMC_2.C | CPWR_2.2 50.4,27.9 49.2,26.7 46,26.7 45.3,27.4 V_REG_3.3.2 | 58.4,35.37 CRMC_1.1 57.5,35.4 54.73,32.63 CLMC_2.C | U$11.GND 44.42,43.08 45.2,42.3 V_REG_5.0.4 | V_REG_5.0.4 | 57.1,47.5 57,47.5 53.33,51.17 CRMC_2.C 54.5,52.67 54.5,53.5 56,55 56,59 56.85,59.85 JP1.3 | 57.1,47.5 CLMC_1.1 | CEM_4.2 CEM_3.1 80.1,43.7 78,45.8 R_RE_LF.1 74.2,47.1 74.2,49.3 75.12,50.22 CEM_10.2 75.42,51.86 CEM_9.1 75.3,51.8 73,51.8 | CEM_4.2 76.7,38.3 76.2,37.8 | 76.2,37.8 R_RE_RF.1 | U$6.AGND 75.41,38.59 76.2,37.8 | U$16.N1S/N2S 64.36,57.35 v65,58 66,58 66.75,58.75 | 66.75,58.75 66.72,58.78 CEM_2.2 CEM_1.1 64.79,62.5 R_RE_L.1 | 66.75,58.75 67.5,58 69,58 69.5,57.5 69.5,56.6 R_RE_LM.1 69.6,55.2 73,51.8 | CG_4.1 70.5,49.1 | 70.5,49.1 70.5,49.3 73,51.8 | CEM_7.1 77.6,29.55 CEM_8.2 | U$18.N1S/N2S 65.53,21.88 66.2,21.2 | 66.2,21.2 68.2,21.2 68.8,21.8 68.8,23.8 69.5,24.5 R_RE_RM.1 71.1,25.7 71.7,26.3 73.5,26.3 75.7,28.2 CEM_8.2 | 66.2,21.2 66.03,21.03 CEM_5.1 64.48,17.06 CEM_6.2 64.05,17.05 63,16 R_RE_R.1 60.9,17.4 59,19.3 59,21 57.65,22.35 JP2.3 57.8,22.55 57.8,27.2 54.73,30.27 CLMC_2.C | 7.1,27.5 5.5,27.5 5,27 5,26.5 4.5,26 2,26 1.5,26.5 D3.C 1.28,30.12 0.7,30.7 0.7,32.82 D2.C 1.08,33.62 0.7,34 0.7,36.32 D1.C 1.22,37.12 1.12,37.22 | 7.1,27.5 7.3,27.5 7.8,27 | CG_5.1 64.1,37.3 62.9,38.5 62.9,41.3 63.5,41.9 65.8,41.9 66.5,42.6 66.5,48.4 67.4,49.3 70.3,49.3 70.5,49.1
  Top 0.254: V_REG_5.0.4 48.69,39.09 57.1,47.5 | U$1.12 11.98,43.82 12.4,43.4 12.4,42.4 12,42 | U$1.63 19.31,42.5 17.5,42.5 17,42 12,42 | v80,36.5 80,38 CEM_4.2 | 19.5,50.5 MC_1.2 | 12,42 10.5,42 10,42.5 8.15,42.5 U$1.18 3.52,42.52 MC_4.2 1.46,41.3 0.76,42 | 16.68,53.17 16.35,53.5 15,53.5 14.6,53.1 R_LMC_2.1 MC_5.2 9.6,50.5 6.6,50.5 5.4,49.3 4.1,49.3 2.7,50.7 2.7,54 v3.6,54.9 | R_RMC_1.1 16.3,20.5 15,20.5 R_RMC_2.1 10.9,21.7 8.6,24 7,24 6.5,24.5 6.5,26.9 7.1,27.5 | 14.43,28.57 MC_6.2 | JP3.2 14.83,28.17 MC_6.2 | v75,29.5 v75.01,29.5 CEM_8.2 | v22.5,50.5 19.4,50.5 MC_1.2 | 1.12,37.12 1.12,37.22 | 1.12,37.22 1.02,37.32 0.76,37.58 0.76,42 | v3.6,54.9 1.58,54.9 0.76,54.09 0.76,42 | v3.6,54.9 3.6,55.3 2.6,56.3 U$13.-
  Top 0.61: V_REG_3.3.2 45.29,32.6 V_REG_5.0.2
  Bottom 0.254: JP4.2 6.7,54.9 v3.6,54.9 | JP1.3 57.65,59.85 59,58.5 64.5,58.5 v65,58 65,52 64.5,51.5 37.89,51.5 36.07,53.32 36.07,59.42 35.18,60.31 23.81,60.31 22.5,59 v22.5,50.5 | v80,36.5 80,33.5 78.5,32 75,32 74.5,31.5 74.5,30 v75,29.5
L_ENC_A  (via drill 0.5)
  Top 0.254: v10.5,46.8 10.5,44.89 U$1.15
  Bottom 0.254: JP1.6 46.31,57.31 42.67,60.94 20.14,60.94 18.9,59.7 19,48.3 16.8,46.1 11.2,46.1 v10.5,46.8
L_ENC_B  (via drill 0.5)
  Top 0.254: v9.3,47.1 9.3,46.3 10,45.6 10,44.89 U$1.16
  Bottom 0.254: v9.3,47.1 9.8,47.6 10.8,47.6 11.9,46.5 15.9,46.5 16.5,47.1 16.5,50.4 18.5,52.4 18.4,60.3 18.53,60.3 19.81,61.58 42.93,61.58 46.1,58.4 53.22,58.4 JP1.5
L_PWM_A
  Top 0.254: U$1.62 19.35,42 20.3,42 20.5,42.2 20.5,48.9 20.2,49.2 18.5,49.2 17.9,48.6 R_LMC_1.2 16.2,48.6 15.3,47.7 14,47.7 13.6,48.1 13.6,48.9 14,49.3 15.3,49.3 15.6,49.6 15.6,51.3 16.02,51.73 U$15.IN_A
L_PWM_B
  Top 0.254: R_LMC_2.2 15.6,48.6 16.2,49.2 | 16.2,49.2 18,49.2 18.4,49.6 20.4,49.6 20.9,49.2 20.9,42 20.4,41.5 19.35,41.5 U$1.61 | U$15.IN_B 17.32,51.92 17,51.6 16.4,51.6 16,51.2 16,49.4 16.2,49.2
LED1
  Top 0.254: U$1.25 4.92,39.02 R_LED_1.2
LED2
  Top 0.254: U$1.29 6.92,37.02 6.1,36.2 6.1,34.1 5.6,33.6 R_LED_2.2
LED3
  Top 0.254: U$1.30 7.02,36.52 6.5,36 6.5,33 4.8,31.3 4.8,30.4 4.5,30.1 R_LED_3.2
N$1
  Top 0.254: U$6.AVCC 66.39,39.39 65.5,38.5 65.5,36.6 CG_5.2 L3.1
N$2
  Top 0.406: D2.A 2.98,35.38 R_LED_2.1
N$3
  Top 0.254: U$6.ST2 U$6.ST1 73.71,41.79 | CG_1.1 73.1,42.78 U$6.PGND
N$4
  Top 0.254: CG_4.2 70.5,45.7 71.3,44.9 U$6.CP5
N$5
  Top 0.254: CG_2.2 68,45.6 69,44.6 69.6,44.6 69.9,44.3 69.9,42.78 69.71,42.59
N$6
  Top 0.254: MC_6.1 13.1,30.6 12.3,29.8 10.4,29.8 10.1,29.5 5.7,29.5 5.2,30 5.2,31.2 6.9,32.9 6.9,35.6 7.3,36 8.11,36 U$1.31
N$7
  Top 0.254: U$1.47 16.98,30.88 MC_7.1
N$8
  Top 0.254: U$6.CP3 70.51,44.49 70,45 69.5,45 69,45.5 69,46.7 CG_2.1
N$9
  Top 0.254: U$6.CP2 65.79,40.19 CG_3.1
N$10
  Top 0.254: U$6.CP1 64.4,40.99 CG_3.2
N$11
  Top 0.254: U$6.VRATIO 72.11,34.49 L2.2
N$12
  Top 0.254: G_R.2 70.64,31.89 71.5,32.75 71.5,36.05 70.48,37.07 70.48,37.77 U$6.SUMJ
  Top 0.406: CG_6.1 68.71,31.91 68.71,31.99 70.53,31.99 G_R.2
N$13
  Bottom 0.406: U$13.+ 4.5,60.7 4.5,61.5 4,62 1.5,62 0.76,61.26 0.76,17.13 1.89,16 3.49,16 U$12.-
N$14
  Bottom 0.254: U$12.+ 2.53,17.39 1.65,18.27 1.65,22.21 2.92,23.48 2.92,24.33 U$14.PIN2
N$15
  Top 0.254: U$7.- 59.02,72.02 58.3,71.3 R_EM_L.2
N$16
  Top 0.254: U$11.1C 50.12,47.62 51,48.5 51,62.62 51.02,62.62 51.7,63.3 56.8,63.3 58.3,64.8 R_EM_L.1
N$17  (via drill 0.5)
  Top 0.254: U$11.3C 51.33,46.33 v52.8,47.8 | v80.7,48.5 80.7,44.2 81.4,43.5 R_EM_LF.1
  Bottom 0.254: v52.8,47.8 54.4,49.4 79.8,49.4 v80.7,48.5
N$18
  Top 0.406: D1.A 2.98,38.88 R_LED_1.1
N$19  (via drill 0.5)
  Top 0.254: U$11.4C 51.98,45.67 v54.1,47.8 | v78.32,40.67 R_EM_RF.1
  Bottom 0.254: v54.1,47.8 55,48.7 77.8,48.7 78.32,50.98 v78.32,40.67
N$20
  Top 0.254: U$9.- 79.06,34.46 R_EM_RF.2
N$21  (via drill 0.5)
  Top 0.254: R_EM_R.1 58.1,14.4 54.4,18.1 v52.5,18.1 | v49.8,43.2 49.8,43.9 49.3,44.4 47.9,44.4 U$11.6C
  Bottom 0.254: v49.8,43.2 49.8,18.76 49.84,18.76 50.5,18.1 v52.5,18.1
N$22
  Top 0.254: U$10.- 57.94,4.56 57,5.5 57,9.6 R_EM_R.2
N$25  (via drill 0.5)
  Top 0.254: 17.3,56.55 U$15.OUT_B 17.27,56.58 17.27,59.42 18.8,60.94 35.56,60.94 40.4,56.1 v50.2,56.1 | U$16.N2G 63.1,55.99 v63.1,53.2 63.1,50.62 U$16.P2G
  Bottom 0.254: v50.2,56.1 58.1,56.1 61,53.2 v63.1,53.2
N$26  (via drill 0.5)
  Top 0.254: U$16.P1G 66.89,53 | 66.89,53 U$16.N1G 66.89,53.4 | U$15.OUT_A 16,56.55 16,57.2 15.7,57.5 15.2,57.5 14.8,57.1 14.8,55.7 15.2,55.3 17.5,55.3 17.91,55.71 17.91,58.4 19.81,60.31 35.05,60.31 40.26,55.1 v49.5,55.1 | v63.9,52.4 66.3,52.4 66.89,53
  Bottom 0.254: v63.9,52.4 61.1,52.4 58.4,55.1 v49.5,55.1
N$27
  Top 0.254: U$16.N1D/P1D 65.62,54.92 65.1,54.4 64.3,54.4 63.7,55 63.7,58.4 62.2,59.9 59.8,59.9 JP1.1
N$28
  Top 0.254: U$16.N2D/P2D 64.36,49.55 63.7,48.9 62.6,48.9 61.9,49.6 61.9,56.7 61.3,57.3 JP1.2
N$33  (via drill 0.5)
  Top 0.254: U$17.OUT_B 7.08,20.93 9.9,18.1 19.4,18.1 20.4,17.1 35.1,17.1 36.9,18.9 36.9,24.2 37.9,25.2 v53.6,25.2 | v66.8,25.2 U$18.N2G U$18.P2G
  Bottom 0.254: v53.6,25.2 v66.8,25.2
N$34  (via drill 0.5)
  Top 0.254: U$17.OUT_A 8.38,21.62 10.7,19.4 22.7,19.3 23.6,19.3 24.4,18.4 25.2,17.6 34.9,17.6 36.2,18.9 36.2,24.7 37.5,26 v54.6,26 | U$18.P1G 63,28.38 v63,26 63,23 U$18.N1G
  Bottom 0.254: v54.6,26 v63,26
N$35
  Top 0.254: U$18.N1D/P1D 64.25,20.36 63.7,19.8 JP2.2
N$36  (via drill 0.5)
  Top 0.254: U$18.N2D/P2D 65.53,29.32 66.1,29.9 67.9,29.9 68.5,29.3 v68.5,27.9
  Bottom 0.254: v68.5,27.9 68.5,23 67.9,22.4 60.19,22.4 JP2.1
N$40
  Top 0.406: D3.A 2.98,31.88 R_LED_3.1
N$41
  Top 0.406: C_NRST1.2 R_NRST1.1
  Top 0.61: BTN2.1 4.95,46.95 R_NRST1.1
N$42  (via drill 0.5)
  Top 0.254: U$11.2C 50.58,46.98 v51.4,47.8 | v81.5,55.2 R_EM_LM.1
  Bottom 0.254: v51.4,47.8 67.32,50.38 90.02,50.38 v81.5,55.2
N$46
  Top 0.254: U$20.- 78.77,58.77 79.5,59.5 81.4,59.5 R_EM_LM.2
N$47
  Top 0.254: U$21.- 76.23,24.84 R_EM_RM.2
N$48  (via drill 0.5)
  Top 0.254: R_EM_RM.1 69.92,27.62 v69.9,27.6 | v50.7,45 47.9,45 U$11.5C
  Bottom 0.254: v69.9,27.6 69.9,28.8 68.6,30.1 51.6,30.1 50.7,31 v50.7,45
NRST
  Top 0.254: U$1.7 14.48,46.22 11.1,49.6 6.6,49.6 5.7,48.7 3.45,48.7 BTN1.2
  Top 0.61: BTN1.2 1.45,52.95 C_NRST.1
NRST2
  Top 0.254: R_NRST.1 5,53.4 5,55.7 4,56.7 4,58 4.5,58.5 6.1,58.5 JP4.3
  Top 0.406: C_NRST.2 R_NRST.1
  Top 0.61: BTN1.1 4.95,53.15 R_NRST.1
R_EM_RF
  Top 0.254: R_EM_LF.2 88.44,43.5 U$8.-
R_ENC_A  (via drill 0.5)
  Top 0.254: U$1.50 21.98,36.02 23.5,34.5 24,34.5 24.4,34.9 24.4,36.6 24.9,37.1 36.1,37.1 36.9,36.3 47.5,36.3 v47.7,36.5 | v48.7,19.8 JP2.6
  Bottom 0.254: v47.7,36.5 47.7,20.8 v48.7,19.8
R_ENC_B  (via drill 0.5)
  Top 0.254: U$1.55 21.42,38.52 23.1,40.2 v38.34,40.2 | v48.7,22.4 55.01,22.4 JP2.5
  Bottom 0.254: 47.2,39.8 47.57,39.46 | 47.57,39.46 48.7,38.4 v48.7,22.4 | v38.34,40.2 46.82,40.2 47.57,39.46
R_PWM_A
  Top 0.254: U$17.IN_A 8.38,25.93 11.1,23.2 18.9,23.2 19.3,22.8 R_RMC_1.2 20,21.7 21.5,23.2 21.5,31.1 17.4,35.2 17.4,39.8 18.1,40.5 19.31,40.5 U$1.59
R_PWM_B
  Top 0.254: U$17.IN_B 7.08,25.12 7.7,24.5 9.1,24.5 10.9,22.7 14.6,22.7 R_RMC_2.2 16.6,22.7 18.1,22.7 18.6,22.2 18.6,21 19,20.6 20,20.6 22.1,22.7 22.1,31.3 18,35.4 18,39.5 18.5,40 19.31,40 U$1.58
RE_L  (via drill 0.5)
  Top 0.254: U$2.E 61.1,68.6 60.4,67.9 60.4,62.7 R_RE_L.2 v59,62.5 | v5.5,41 6,41.5 8.11,41.5 U$1.20
  Bottom 0.254: v5.5,41 6,41.5 7.4,41.5 8,42.1 8,51 9,52 16,52 17,53 17,61.9 18.4,63.3 56.6,63.3 57.4,62.5 v59,62.5
RE_LF  (via drill 0.5)
  Top 0.254: U$3.E 78.62,50.22 78.62,49.22 77.1,47.7 R_RE_LF.2 | U$1.21 6.82,41.02 6.5,40.7 v6.5,40.3
  Bottom 0.254: U$3.E 82.55,50.2 83.6,50.2 84.3,50.9 84.3,57.2 83.6,57.9 72.6,57.9 71.9,58.6 71.9,59.4 69.6,61.7 50.3,61.7 48.5,59.9 46.3,59.9 45.6,60.6 45.6,61.8 44.8,62.6 18.4,62.6 17.5,61.7 17.5,53 16,51.5 9.2,51.5 8.5,50.8 8.5,40.9 7.9,40.3 v6.5,40.3
RE_LM  (via drill 0.5)
  Top 0.254: v12.2,47.3 13.5,46 13.5,44.89 U$1.9 | U$23.E 70.73,57.17 R_RE_LM.2
  Bottom 0.254: v12.2,47.3 11.7,47.8 11.7,50.4 12.3,51 16,51 18,53 18,61.5 18.6,62.1 43.2,62.1 46.2,59.1 48.7,59.1 50.8,61.2 67.3,61.2 69.4,59.1 70.63,59.1 U$23.E
RE_R  (via drill 0.5)
  Top 0.254: U$5.E 60.04,12.46 59.1,13.4 R_RE_R.2 v57.6,16 | U$1.27 6.62,38.02 v6.3,37.7
  Bottom 0.254: v6.3,37.7 4.7,36.1 4.7,20.4 6.9,18.2 13.9,18.2 14.6,17.5 14.6,16.3 15.8,15.1 44.4,15.1 45.7,16.4 45.7,17.74 46.1,18.14 48.77,18.14 50.16,16.75 50.16,16.73 50.9,16 v57.6,16
RE_RF  (via drill 0.5)
  Top 0.254: U$4.E 84.48,32.52 84,33 77.3,33 R_RE_RF.2 | U$1.26 5.72,38.52 v4.9,37.7
  Bottom 0.254: U$4.E 83.9,31.3 81.7,31.3 81,30.6 81,26.9 80,25.9 70.4,25.9 69.5,25 69.5,15.8 68.3,14.6 7.3,14.6 6.1,15.8 6.1,18.4 4.1,20.4 4.1,36.8 4.9,37.6 v4.9,37.7
RE_RM  (via drill 0.5)
  Top 0.254: R_RE_RM.2 73,24.4 73,23 73.27,22.73 U$22.E 71.77,20 v68.5,20 | v13.3,43 13,43.3 13,44.85 U$1.10
  Bottom 0.254: v68.5,20 68.4,20.1 65.6,20.1 62.7,17.2 50.6,17.2 49.15,18.65 45.85,18.65 45.09,17.89 45.09,16.49 44.2,15.61 16,15.61 15.24,16.37 15.24,17.64 13.97,18.91 11.58,18.91 10.7,19.79 10.7,28.7 14,32 14,42.3 v13.3,43
RX
  Top 0.254: U$1.43 14.98,32.72 15.7,32 15.7,30.2 16,29.9 20.4,29.9 20.8,29.5 20.8,28.1 19.91,27.21 JP3.4
SWDCLK  (via drill 0.5)
  Top 0.254: U$1.49 21.88,35.52 24,33.4 v24,33.38 | v20.7,54.7 14,54.7 13.4,55.3 JP4.5
  Bottom 0.254: v20.7,54.7 21.5,53.9 21.5,49.1 24.38,46.21 24.38,33.8 24.4,33.78 v24,33.38
SWDIO  (via drill 0.5)
  Top 0.254: U$1.46 16.48,34.82 15.9,35.4 v13,35.4
  Bottom 0.254: v13,35.4 11.2,35.4 10.4,36.2 10.4,38.8 9.7,39.5 2.65,39.5 2.03,40.12 2.03,57.33 3.2,58.5 10.1,58.5 JP4.4
TX
  Top 0.254: U$1.42 14.48,32.02 15.2,31.3 15.2,30 15.7,29.5 20.1,29.5 20.4,29.2 20.4,28.2 20,27.8 18.1,27.8 17.37,27.07 JP3.3
V_BAT  (via drill 0.5)
  Top 0.254: V_REG_5.0.1 40.92,32.68 CPWR_1.1 40.4,33.4 | 59.5,36.5 60.2,35.8 CRMC_1.2 61.07,34.53 CLMC_2.A 63.7,31.7 64.2,31.2 64.2,28.45 U$18.P1S/P2S | 59.5,36.5 57.9,36.5 56.1,34.7 41,34.7 40.4,34.1 40.4,33.4 | U$16.P1S/P2S 65.62,49.12 65,48.5 62.3,48.5 61.3,49.5 61.3,50.9 60.7,51.5 CRMC_2.A 59.67,47.73 CLMC_1.2 59.9,36.9 59.5,36.5 | 40.4,33.4 36.5,29.5 v36.5,26.5 | v1.7,23.7 2.4,23 3.5,23 4,23.5 7.5,23.5 7.7,23.3 7.7,22.32 U$17.VDD 7.7,22.27 7.7,21.3 10.22,18.78 21.08,18.78 v21.84,18.02 | v13.1,59.5 15.4,59.5 16.7,58.2 16.7,56.55 U$15.VDD
  Top 0.61: R_VMTR_1.2 3.54,28.8 3.05,28.3 3.05,27 U$14.PIN3
  Bottom 0.254: v36.5,26.5 36.5,18.4 35.1,17 22.86,17 v21.84,18.02 | v13.1,59.5 2.8,59.5 1.52,58.22 1.52,28.81 3.01,27.33 U$14.PIN3 | 1.65,23.73 1.65,25.6 U$14.PIN3 | U$14.PIN3 3.01,27.28 3,27.29
  Bottom 0.406: v1.7,23.7 1.65,23.7 1.65,23.73
VMTR
  Top 0.254: U$1.24 8.15,39.5 9.2,39.5 9.5,39.2 9.5,35.4 8.4,34.3 8.4,32.2 9.2,31.4 R_VMTR_2.2
  Top 0.61: R_VMTR_2.2 R_VMTR_1.1